# EAGLE schematic ssm2166board (EAGLE 6.3)
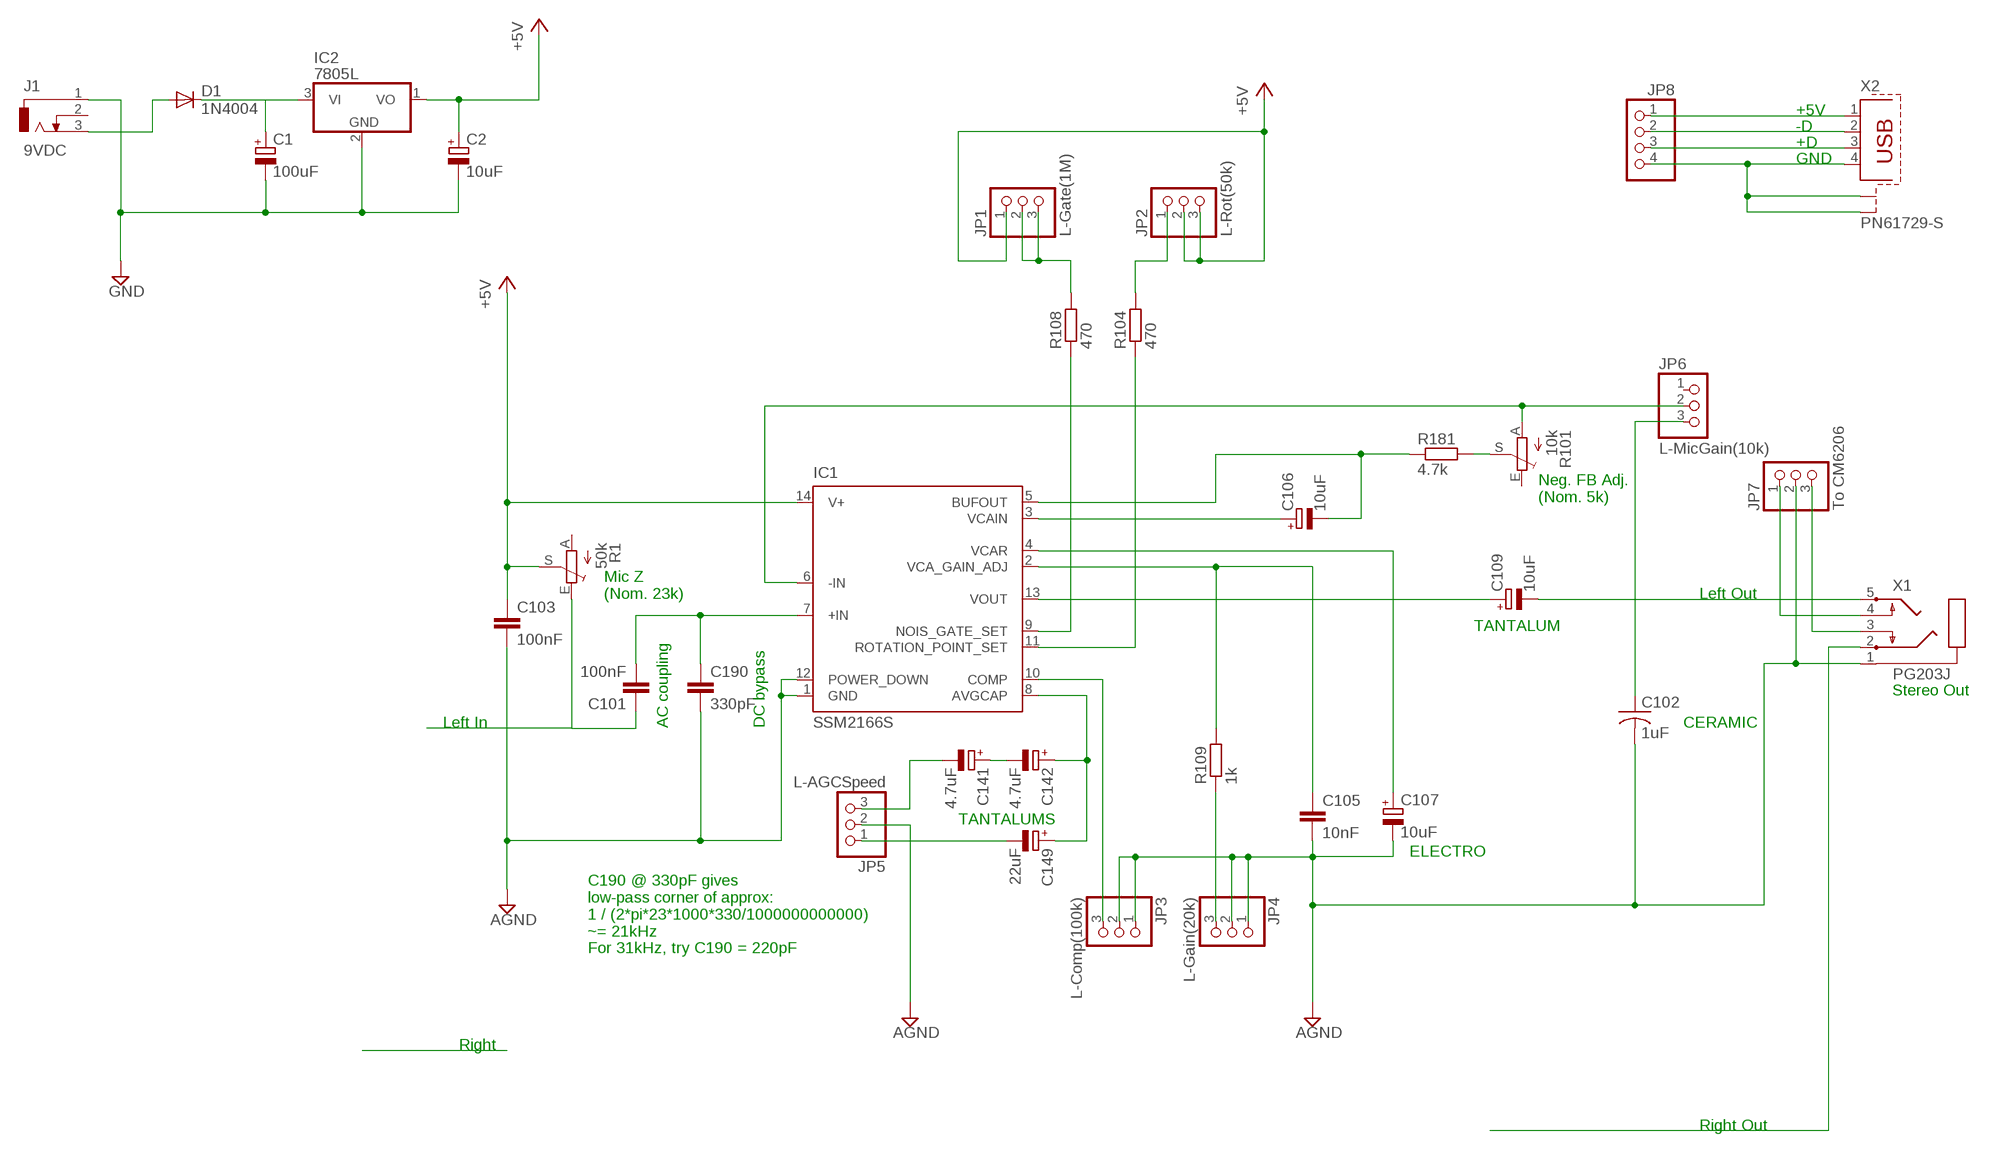
[diagram p0: schematic, sheet 1]

## Parts
C1  100uF  CPOL-EUE2-5  [E2-5]
C2  10uF  CPOL-EUE2-5  [E2-5]
C101  100nF  C-EUC1206  [C1206]
C102  1uF  C-USC2220K  [C2220K]
C103  100nF  C-EUC1206  [C1206]
C105  10nF  C-EUC1206  [C1206]
C106  10uF  CPOL-EUE2-5  [E2-5]
C107  10uF  CPOL-EUE2-5  [E2-5]
C109  10uF  CPOL-EUCT6032  [CT6032]
C141  4.7uF  CPOL-EUCT6032  [CT6032]
C142  4.7uF  CPOL-EUCT6032  [CT6032]
C149  22uF  CPOL-EUCT7343  [CT7343]
C190  330pF  C-EUC1206  [C1206]
D1  1N4004  [DO41-10]
IC1  SSM2166S  [SO14]
IC2  7805L  [TO92]
J1  9VDC  DCJ0303  [DCJ0303]
JP1  L-Gate(1M)  PINHD-1X3  [1X03]
JP2  L-Rot(50k)  PINHD-1X3  [1X03]
JP3  L-Comp(100k)  PINHD-1X3  [1X03]
JP4  L-Gain(20k)  PINHD-1X3  [1X03]
JP5  L-AGCSpeed  PINHD-1X3  [1X03]
JP6  L-MicGain(10k)  PINHD-1X3  [1X03]
JP7  To CM6206  PINHD-1X3  [1X03]
JP8  PINHD-1X4  [1X04]
R1  50k  TRIM_EU-CA6V  [CA6V]
R101  10k  TRIM_EU-CA6V  [CA6V]
R104  470  R-EU_R1206  [R1206]
R108  470  R-EU_R1206  [R1206]
R109  1k  R-EU_R1206  [R1206]
R181  4.7k  R-EU_R1206  [R1206]
X1  PG203J  [PG203J]
X2  PN61729-S  [PN61729-S]

## Nets
+5V: C2.+ C103.1 IC1.14(V+) IC2.1(VO) JP1.1 JP2.2 JP2.3 R1.S
AGND: C102.2 C103.2 C105.2 C107.- C190.2 IC1.1(GND) IC1.12(POWER_DOWN) JP3.1 JP3.2 JP4.1 JP4.2 JP5.2 JP7.2 X1.1
GND: C1.- C2.- IC2.2(GND) J1.1
N$1: C105.1 IC1.2(VCA_GAIN_ADJ) R109.2
N$2: C107.+ IC1.4(VCAR)
N$3: C101.2 C190.1 IC1.7(+IN)
N$4: IC1.9(NOIS_GATE_SET) R108.1
N$5: IC1.11(ROTATION_POINT_SET) R104.1
N$6: C106.+ IC1.3(VCAIN)
N$7: C106.- IC1.5(BUFOUT) R181.1
N$8: IC1.10(COMP) JP3.3
N$9: JP2.1 R104.2
N$10: IC1.6(-IN) JP6.2 R101.A
N$11: R101.S R181.2
N$12: JP7.1 X1.4
N$13: JP1.2 JP1.3 R108.2
N$14: C141.- JP5.3
N$15: JP4.3 R109.1
N$16: C141.+ C142.-
N$17: C149.- JP5.1
N$18: C142.+ C149.+ IC1.8(AVGCAP)
N$19: C102.1 JP6.3
N$20: C109.+ IC1.13(VOUT)
N$21: C109.- X1.5
N$22: C101.1 R1.E
N$24: JP7.3 X1.3
N$25: X1.2
N$26: JP8.1 X2.1
N$27: JP8.2 X2.2
N$28: JP8.3 X2.3
N$29: JP8.4 X2.4 X2.S1 X2.S2
N$30: C1.+ D1.C IC2.3(VI)
N$33: D1.A J1.3
Unconnected: J1.2 JP6.1 R1.A R101.E

## Notes on the sheet
- +5V
- -D
- +D
- GND
- Neg. FB Adj.
  (Nom. 5k)
- Mic Z
  (Nom. 23k)
- Left Out
- TANTALUM
- Stereo Out
- Left In | AC coupling | DC bypass | CERAMIC
- TANTALUMS
- ELECTRO
- C190 @ 330pF gives
  low-pass corner of approx:
  1 / (2*pi*23*1000*330/1000000000000)
  ~= 21kHz
  For 31kHz, try C190 = 220pF
- Right
- Right Out

## Library data of the parts
C1 C2 C106 C107 = rcl:CPOL-EU: POLARIZED CAPACITOR, European symbol
C101 C103 C105 C190 = rcl:C-EU: CAPACITOR, European symbol
C102 = resistor:C-US: CAPACITOR, American symbol
C109 C141 C142 C149 = resistor:CPOL-EU: POLARIZED CAPACITOR, European symbol
D1 = diode:1N4004: DIODE general purpose rectifier, 1 A
IC1 = analog-devices:SSM2166: Microphone Preamplifier with Variable Compression and Noise Gating Source: http://www.analog.com/static/imported-files/data_sheets/SSM2166.pdf; MF: ALTERA CORPORATION; MPN: SSM2166S-REEL; OC_FARNELL: 1424669; OC_NEWARK: 13B4818
IC2 = linear:78*: Positive VOLTAGE REGULATOR Source: http://cache.national.com/ds/LM/LM78L05.pdf http://www.fairchildsemi.com/ds/LM/LM7805.pdf
J1 = con-jack:DCJ0303: DC POWER JACK Source: DCJ0303.pdf; OC_FARNELL: unknown; OC_NEWARK: unknown
JP1-JP7 = anton:PINHD-1X3: PIN HEADER
JP8 = anton:PINHD-1X4: PIN HEADER
R1 R101 = pot:TRIM_EU-: POTENTIOMETER
R104 R108 R109 R181 = rcl:R-EU_: RESISTOR, European symbol
X1 = con-hirschmann:PG203J: MIC/HEADPHONE JACK KS-S stereo microphone/headphone jack PG203JN (Schukat); OC_FARNELL: unknown; OC_NEWARK: unknown
X2 = con-berg:PN61729-S: BERG USB connector; OC_FARNELL: unknown; OC_NEWARK: unknown